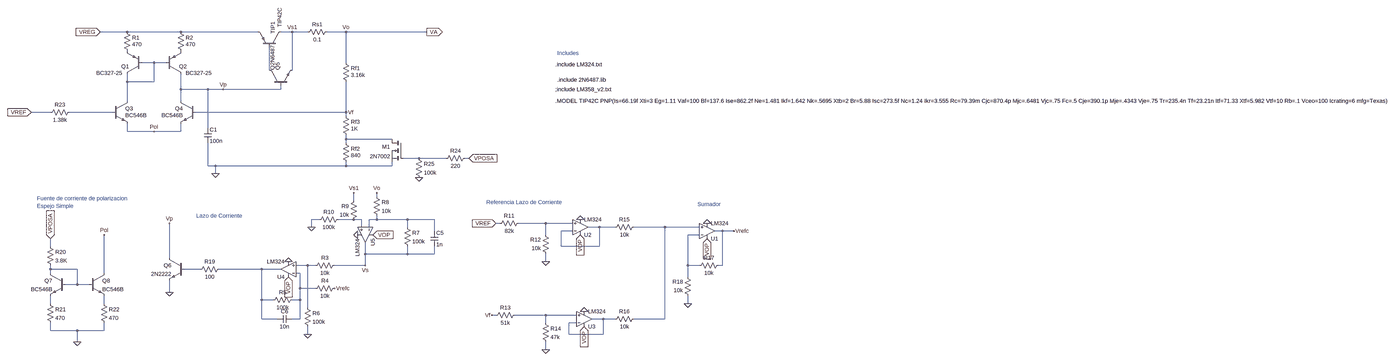
[diagram p0: schematic LDOA_v2.asc, whole sheet]
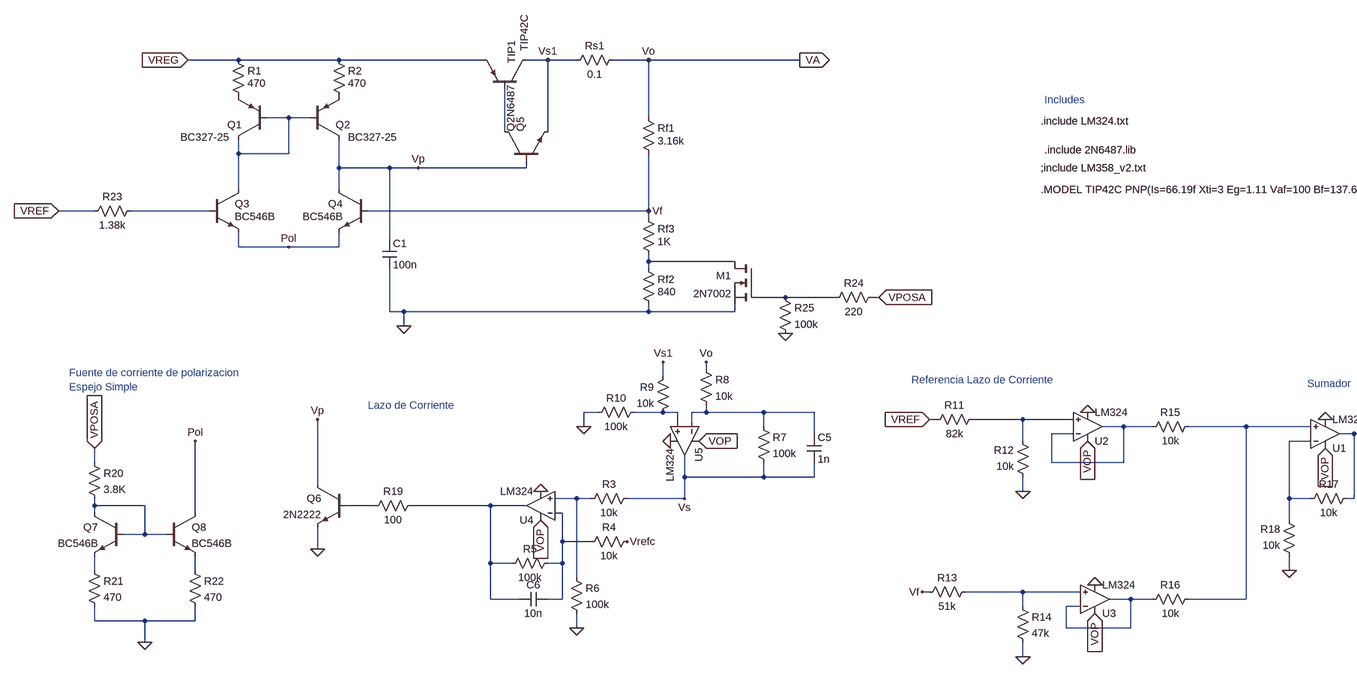
[diagram p1: schematic LDOA_v2.asc, part, row 1 of 1, column 1 of 2]
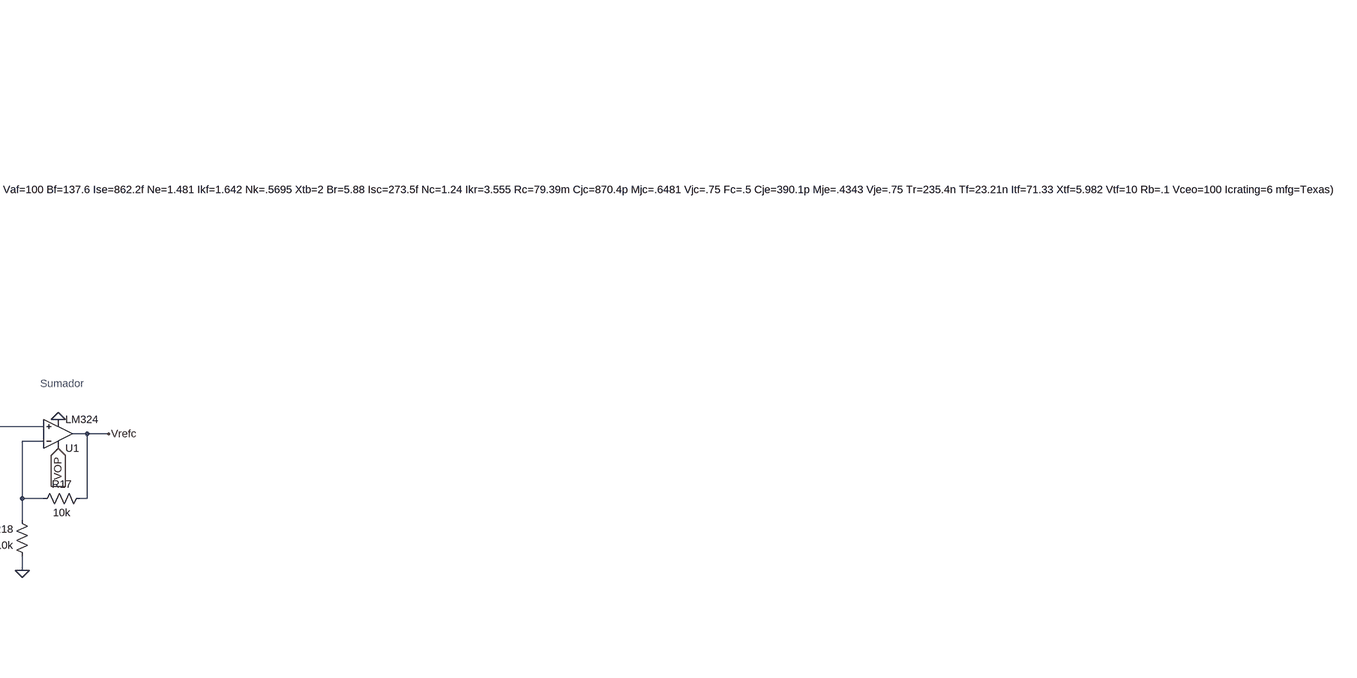
[diagram p2: schematic LDOA_v2.asc, part, row 1 of 1, column 2 of 2]
LDOA_v2.asc, the LTspice schematic file:
Version 4
SHEET 1 3904 1396
WIRE -1760 -688 -1872 -688
WIRE -1536 -688 -1760 -688
WIRE -1216 -688 -1536 -688
WIRE -1072 -688 -1120 -688
WIRE -1008 -688 -1072 -688
WIRE -848 -688 -928 -688
WIRE -512 -688 -848 -688
WIRE -1648 -560 -1696 -560
WIRE -1600 -560 -1648 -560
WIRE -848 -560 -848 -688
WIRE -1168 -528 -1168 -624
WIRE -1072 -528 -1072 -688
WIRE -1760 -480 -1760 -512
WIRE -1648 -480 -1648 -560
WIRE -1648 -480 -1760 -480
WIRE -1536 -448 -1536 -512
WIRE -1424 -448 -1536 -448
WIRE -1360 -448 -1424 -448
WIRE -1120 -448 -1120 -464
WIRE -1120 -448 -1360 -448
WIRE -1760 -400 -1760 -480
WIRE -1536 -400 -1536 -448
WIRE -2080 -352 -2160 -352
WIRE -1824 -352 -2000 -352
WIRE -848 -352 -848 -480
WIRE -848 -352 -1472 -352
WIRE -848 -336 -848 -352
WIRE -1424 -288 -1424 -448
WIRE -1760 -272 -1760 -304
WIRE -1648 -272 -1760 -272
WIRE -1536 -272 -1536 -304
WIRE -1536 -272 -1648 -272
WIRE -848 -240 -848 -256
WIRE -656 -240 -848 -240
WIRE -848 -224 -848 -240
WIRE -544 -160 -608 -160
WIRE -432 -160 -544 -160
WIRE -336 -160 -352 -160
WIRE -1424 -128 -1424 -224
WIRE -1392 -128 -1424 -128
WIRE -848 -128 -848 -144
WIRE -848 -128 -1392 -128
WIRE -656 -128 -656 -144
WIRE -656 -128 -848 -128
WIRE -1392 -96 -1392 -128
WIRE -720 0 -720 -16
WIRE -816 16 -816 -16
WIRE -960 96 -992 96
WIRE -816 96 -880 96
WIRE -784 96 -816 96
WIRE -720 96 -720 80
WIRE -720 96 -752 96
WIRE -592 96 -720 96
WIRE -480 96 -592 96
WIRE -208 112 -224 112
WIRE -16 112 -128 112
WIRE 96 112 -16 112
WIRE -992 128 -992 96
WIRE -784 128 -784 96
WIRE -752 128 -752 96
WIRE -592 128 -592 96
WIRE 208 128 160 128
WIRE 272 128 208 128
WIRE 480 128 352 128
WIRE 624 128 480 128
WIRE -480 144 -480 96
WIRE 96 144 48 144
WIRE 720 144 688 144
WIRE 768 144 720 144
WIRE -16 160 -16 112
WIRE 624 160 576 160
WIRE -2080 208 -2080 176
WIRE 48 208 48 144
WIRE 208 208 208 128
WIRE 208 208 48 208
WIRE -768 240 -768 192
WIRE -592 240 -592 208
WIRE -592 240 -768 240
WIRE -480 240 -480 208
WIRE -480 240 -592 240
WIRE -1584 256 -1584 112
WIRE -16 272 -16 240
WIRE -1008 288 -1056 288
WIRE -976 288 -1008 288
WIRE -768 288 -768 240
WIRE -768 288 -896 288
WIRE 576 288 576 160
WIRE 624 288 576 288
WIRE 720 288 720 144
WIRE 720 288 704 288
WIRE -2080 304 -2080 288
WIRE -1968 304 -2080 304
WIRE -1456 304 -1520 304
WIRE -1200 304 -1376 304
WIRE -1120 304 -1200 304
WIRE -2080 320 -2080 304
WIRE -1856 320 -1856 160
WIRE -1040 320 -1056 320
WIRE 576 336 576 288
WIRE -1968 368 -1968 304
WIRE -1968 368 -2016 368
WIRE -1920 368 -1968 368
WIRE -1040 384 -1040 320
WIRE -976 384 -1040 384
WIRE -1584 400 -1584 352
WIRE -1200 432 -1200 304
WIRE -1152 432 -1200 432
WIRE -1040 432 -1040 384
WIRE -1040 432 -1072 432
WIRE -2080 448 -2080 416
WIRE -1856 448 -1856 416
WIRE 576 448 576 416
WIRE -1008 464 -1008 288
WIRE -224 496 -240 496
WIRE -16 496 -144 496
WIRE 112 496 -16 496
WIRE -1200 512 -1200 432
WIRE -1136 512 -1200 512
WIRE -1040 512 -1040 432
WIRE -1040 512 -1072 512
WIRE 224 512 176 512
WIRE 272 512 224 512
WIRE 480 512 480 128
WIRE 480 512 352 512
WIRE -16 528 -16 496
WIRE 112 528 80 528
WIRE -2080 560 -2080 528
WIRE -1968 560 -2080 560
WIRE -1856 560 -1856 528
WIRE -1856 560 -1968 560
WIRE -1008 576 -1008 544
WIRE 80 576 80 528
WIRE 224 576 224 512
WIRE 224 576 80 576
WIRE -1968 608 -1968 560
WIRE -16 640 -16 608
FLAG -1392 -96 0
FLAG -848 -352 Vf
FLAG -1072 -688 Vs1
FLAG -1008 576 0
FLAG -896 384 Vrefc
FLAG -992 128 0
FLAG 576 448 0
FLAG -16 640 0
FLAG -16 272 0
FLAG 768 144 Vrefc
FLAG -768 288 Vs
FLAG -1584 400 0
FLAG -1648 -272 Pol
FLAG -1856 160 Pol
FLAG -1968 608 0
FLAG -816 -16 Vs1
FLAG -720 -16 Vo
FLAG -240 496 Vf
FLAG 656 112 0
FLAG 128 96 0
FLAG 144 480 0
FLAG -1088 272 0
FLAG -800 160 0
FLAG -1584 112 Vp
FLAG -1360 -448 Vp
FLAG -544 -80 0
FLAG -1872 -688 VREG
IOPIN -1872 -688 In
FLAG -2160 -352 VREF
IOPIN -2160 -352 In
FLAG -224 112 VREF
IOPIN -224 112 In
FLAG -336 -160 VPOSA
IOPIN -336 -160 In
FLAG -2080 176 VPOSA
IOPIN -2080 176 In
FLAG -1088 336 VOP
IOPIN -1088 336 In
FLAG -736 160 VOP
IOPIN -736 160 In
FLAG 128 160 VOP
IOPIN 128 160 In
FLAG 144 544 VOP
IOPIN 144 544 In
FLAG 656 176 VOP
IOPIN 656 176 In
FLAG -512 -688 VA
IOPIN -512 -688 Out
FLAG -848 -688 Vo
DATAFLAG -608 -688 ""
SYMBOL pnp -1696 -512 R180
WINDOW 3 84 4 Left 2
SYMATTR Value BC327-25
SYMATTR InstName Q1
SYMBOL pnp -1600 -512 M180
WINDOW 3 84 4 Left 2
SYMATTR Value BC327-25
SYMATTR InstName Q2
SYMBOL npn -1824 -400 R0
WINDOW 3 56 60 Left 2
SYMATTR Value BC546B
SYMATTR InstName Q3
SYMBOL npn -1472 -400 M0
WINDOW 3 56 60 Left 2
SYMATTR Value BC546B
SYMATTR InstName Q4
SYMBOL pnp -1120 -624 M270
WINDOW 3 84 4 Left 2
SYMATTR Value TIP42C
SYMATTR InstName TIP1
SYMBOL npn -1168 -464 R270
WINDOW 3 65 14 Left 2
WINDOW 0 64 36 Left 2
SYMATTR Value Q2N6487
SYMATTR InstName Q5
SYMBOL res -864 -576 R0
WINDOW 3 36 68 Left 2
SYMATTR Value 3.16k
SYMATTR InstName Rf1
SYMBOL res -864 -240 R0
WINDOW 3 36 68 Left 2
SYMATTR Value 840
SYMATTR InstName Rf2
SYMBOL res -1776 -704 R0
WINDOW 3 36 68 Left 2
SYMATTR Value 470
SYMATTR InstName R1
SYMBOL res -1552 -704 R0
WINDOW 3 36 68 Left 2
SYMATTR Value 470
SYMATTR InstName R2
SYMBOL res -912 -704 R90
WINDOW 0 0 56 VBottom 2
WINDOW 3 32 56 VTop 2
SYMATTR InstName Rs1
SYMATTR Value 0.1
SYMBOL res -880 272 R90
WINDOW 0 0 56 VBottom 2
WINDOW 3 32 56 VTop 2
SYMATTR InstName R3
SYMATTR Value 10k
SYMBOL res -880 368 R90
WINDOW 0 0 56 VBottom 2
WINDOW 3 32 56 VTop 2
SYMATTR InstName R4
SYMATTR Value 10k
SYMBOL res -1056 416 R90
WINDOW 0 0 56 VBottom 2
WINDOW 3 32 56 VTop 2
SYMATTR InstName R5
SYMATTR Value 100k
SYMBOL res -1024 448 R0
SYMATTR InstName R6
SYMATTR Value 100k
SYMBOL npn -1520 256 M0
SYMATTR InstName Q6
SYMATTR Value 2N2222
SYMBOL res -608 112 R0
SYMATTR InstName R7
SYMATTR Value 100k
SYMBOL res -736 -16 R0
SYMATTR InstName R8
SYMATTR Value 10k
SYMBOL res -800 0 M0
SYMATTR InstName R9
SYMATTR Value 10k
SYMBOL res -864 80 R90
WINDOW 0 0 56 VBottom 2
WINDOW 3 32 56 VTop 2
SYMATTR InstName R10
SYMATTR Value 100k
SYMBOL res -112 96 R90
WINDOW 0 0 56 VBottom 2
WINDOW 3 32 56 VTop 2
SYMATTR InstName R11
SYMATTR Value 82k
SYMBOL res 0 256 R180
WINDOW 0 36 76 Left 2
WINDOW 3 36 40 Left 2
SYMATTR InstName R12
SYMATTR Value 10k
SYMBOL res -240 512 R270
WINDOW 0 32 56 VTop 2
WINDOW 3 0 56 VBottom 2
SYMATTR InstName R13
SYMATTR Value 51k
SYMBOL res -32 512 R0
SYMATTR InstName R14
SYMATTR Value 47k
SYMBOL res 368 112 R90
WINDOW 0 0 56 VBottom 2
WINDOW 3 32 56 VTop 2
SYMATTR InstName R15
SYMATTR Value 10k
SYMBOL res 368 496 R90
WINDOW 0 0 56 VBottom 2
WINDOW 3 32 56 VTop 2
SYMATTR InstName R16
SYMATTR Value 10k
SYMBOL res 720 272 R90
WINDOW 0 0 56 VBottom 2
WINDOW 3 32 56 VTop 2
SYMATTR InstName R17
SYMATTR Value 10k
SYMBOL res 592 432 R180
WINDOW 0 36 76 Left 2
WINDOW 3 36 40 Left 2
SYMATTR InstName R18
SYMATTR Value 10k
SYMBOL res -864 -352 R0
WINDOW 3 36 68 Left 2
SYMATTR Value 1K
SYMATTR InstName Rf3
SYMBOL res -1360 288 R90
WINDOW 0 0 56 VBottom 2
WINDOW 3 32 56 VTop 2
SYMATTR InstName R19
SYMATTR Value 100
SYMBOL npn -2016 320 M0
SYMATTR InstName Q7
SYMATTR Value BC546B
SYMBOL res -2096 192 R0
SYMATTR InstName R20
SYMATTR Value 3.8K
SYMBOL npn -1920 320 R0
SYMATTR InstName Q8
SYMATTR Value BC546B
SYMBOL cap -1440 -288 R0
SYMATTR InstName C1
SYMATTR Value 100n
SYMBOL Opamps\\opamp2 656 208 M180
SYMATTR InstName U1
SYMATTR Value LM324
SYMBOL Opamps\\opamp2 128 192 M180
SYMATTR InstName U2
SYMATTR Value LM324
SYMBOL Opamps\\opamp2 144 576 M180
SYMATTR InstName U3
SYMATTR Value LM324
SYMBOL Opamps\\opamp2 -1088 368 R180
SYMATTR InstName U4
SYMATTR Value LM324
SYMBOL Opamps\\opamp2 -704 160 R90
SYMATTR InstName U5
SYMATTR Value LM324
SYMBOL res -2096 432 R0
SYMATTR InstName R21
SYMATTR Value 470
SYMBOL res -1872 432 R0
SYMATTR InstName R22
SYMATTR Value 470
SYMBOL res -1984 -368 R90
WINDOW 0 0 56 VBottom 2
WINDOW 3 32 56 VTop 2
SYMATTR InstName R23
SYMATTR Value 1.38k
SYMBOL nmos -608 -240 M0
SYMATTR InstName M1
SYMATTR Value 2N7002
SYMBOL res -336 -176 R90
WINDOW 0 0 56 VBottom 2
WINDOW 3 32 56 VTop 2
SYMATTR InstName R24
SYMATTR Value 220
SYMBOL res -560 -176 R0
SYMATTR InstName R25
SYMATTR Value 100k
SYMBOL cap -496 144 R0
SYMATTR InstName C5
SYMATTR Value 1n
SYMBOL cap -1072 496 R90
WINDOW 0 0 32 VBottom 2
WINDOW 3 32 32 VTop 2
SYMATTR InstName C6
SYMATTR Value 10n
TEXT -1472 80 Left 2 ;Lazo de Corriente
TEXT -264 24 Left 2 ;Referencia Lazo de Corriente
TEXT 616 32 Left 2 ;Sumador
TEXT -2136 8 Left 2 ;Fuente de corriente de polarizacion\nEspejo Simple
TEXT 24 -448 Left 2 !;include LM358_v2.txt
TEXT 32 -488 Left 2 !.include 2N6487.lib
TEXT 24 -552 Left 2 !.include LM324.txt
TEXT 32 -600 Left 2 ;Includes
TEXT 24 -400 Left 2 !.MODEL TIP42C PNP(Is=66.19f Xti=3 Eg=1.11 Vaf=100 Bf=137.6 Ise=862.2f Ne=1.481 Ikf=1.642 Nk=.5695 Xtb=2 Br=5.88 Isc=273.5f Nc=1.24 Ikr=3.555 Rc=79.39m Cjc=870.4p Mjc=.6481 Vjc=.75 Fc=.5 Cje=390.1p Mje=.4343 Vje=.75 Tr=235.4n Tf=23.21n Itf=71.33 Xtf=5.982 Vtf=10 Rb=.1 Vceo=100 Icrating=6 mfg=Texas)

The netlist it stands for:
* LDOA_v2.asc
Q1 N001 N001 P001 0 BC327-25
Q2 Vp N001 P002 0 BC327-25
Q3 N001 N003 Pol 0 BC546B
Q4 Vp Vf Pol 0 BC546B
Q§TIP1 Vs1 N002 VREG 0 TIP42C
Q5 N002 Vp Vs1 0 Q2N6487
Rf1 VA Vf 3.16k
Rf2 N004 0 840
R1 VREG P001 470
R2 VREG P002 470
Rs1 VA Vs1 0.1
R3 Vs N012 10k
R4 Vrefc N016 10k
R5 N016 N015 100k
R6 N012 0 100k
Q6 Vp N014 0 0 2N2222
R7 N007 Vs 100k
R8 VA N007 10k
R9 Vs1 N006 10k
R10 N006 0 100k
R11 N008 VREF 82k
R12 0 N008 10k
R13 Vf N019 51k
R14 N019 0 47k
R15 N010 N009 10k
R16 N010 N020 10k
R17 Vrefc N011 10k
R18 0 N011 10k
Rf3 Vf N004 1K
R19 N015 N014 100
Q7 N013 N013 N017 0 BC546B
R20 VPOSA N013 3.8K
Q8 Pol N013 N018 0 BC546B
C1 Vp 0 100n
XU1 N010 N011 VOP 0 Vrefc LM324  ; pins In+ In- V+ V- OUT
XU2 N008 N009 VOP 0 N009 LM324  ; pins In+ In- V+ V- OUT
XU3 N019 N020 VOP 0 N020 LM324  ; pins In+ In- V+ V- OUT
XU4 N012 N016 VOP 0 N015 LM324  ; pins In+ In- V+ V- OUT
XU5 N006 N007 VOP 0 Vs LM324  ; pins In+ In- V+ V- OUT
R21 N017 0 470
R22 N018 0 470
R23 N003 VREF 1.38k
M1 N004 N005 0 0 2N7002
R24 VPOSA N005 220
R25 N005 0 100k
C5 N007 Vs 1n
C6 N016 N015 10n
.model NPN NPN
.model PNP PNP
.lib standard.bjt
.model NMOS NMOS
.model PMOS PMOS
.lib standard.mos
* Lazo de Corriente
* Referencia Lazo de Corriente
* Sumador
* Fuente de corriente de polarizacion
* Espejo Simple
;include LM358_v2.txt
.include 2N6487.lib
.include LM324.txt
* Includes
.MODEL TIP42C PNP(Is=66.19f Xti=3 Eg=1.11 Vaf=100 Bf=137.6 Ise=862.2f Ne=1.481 Ikf=1.642 Nk=.5695 Xtb=2 Br=5.88 Isc=273.5f Nc=1.24 Ikr=3.555 Rc=79.39m Cjc=870.4p Mjc=.6481 Vjc=.75 Fc=.5 Cje=390.1p Mje=.4343 Vje=.75 Tr=235.4n Tf=23.21n Itf=71.33 Xtf=5.982 Vtf=10 Rb=.1 Vceo=100 Icrating=6 mfg=Texas)
.backanno
.end